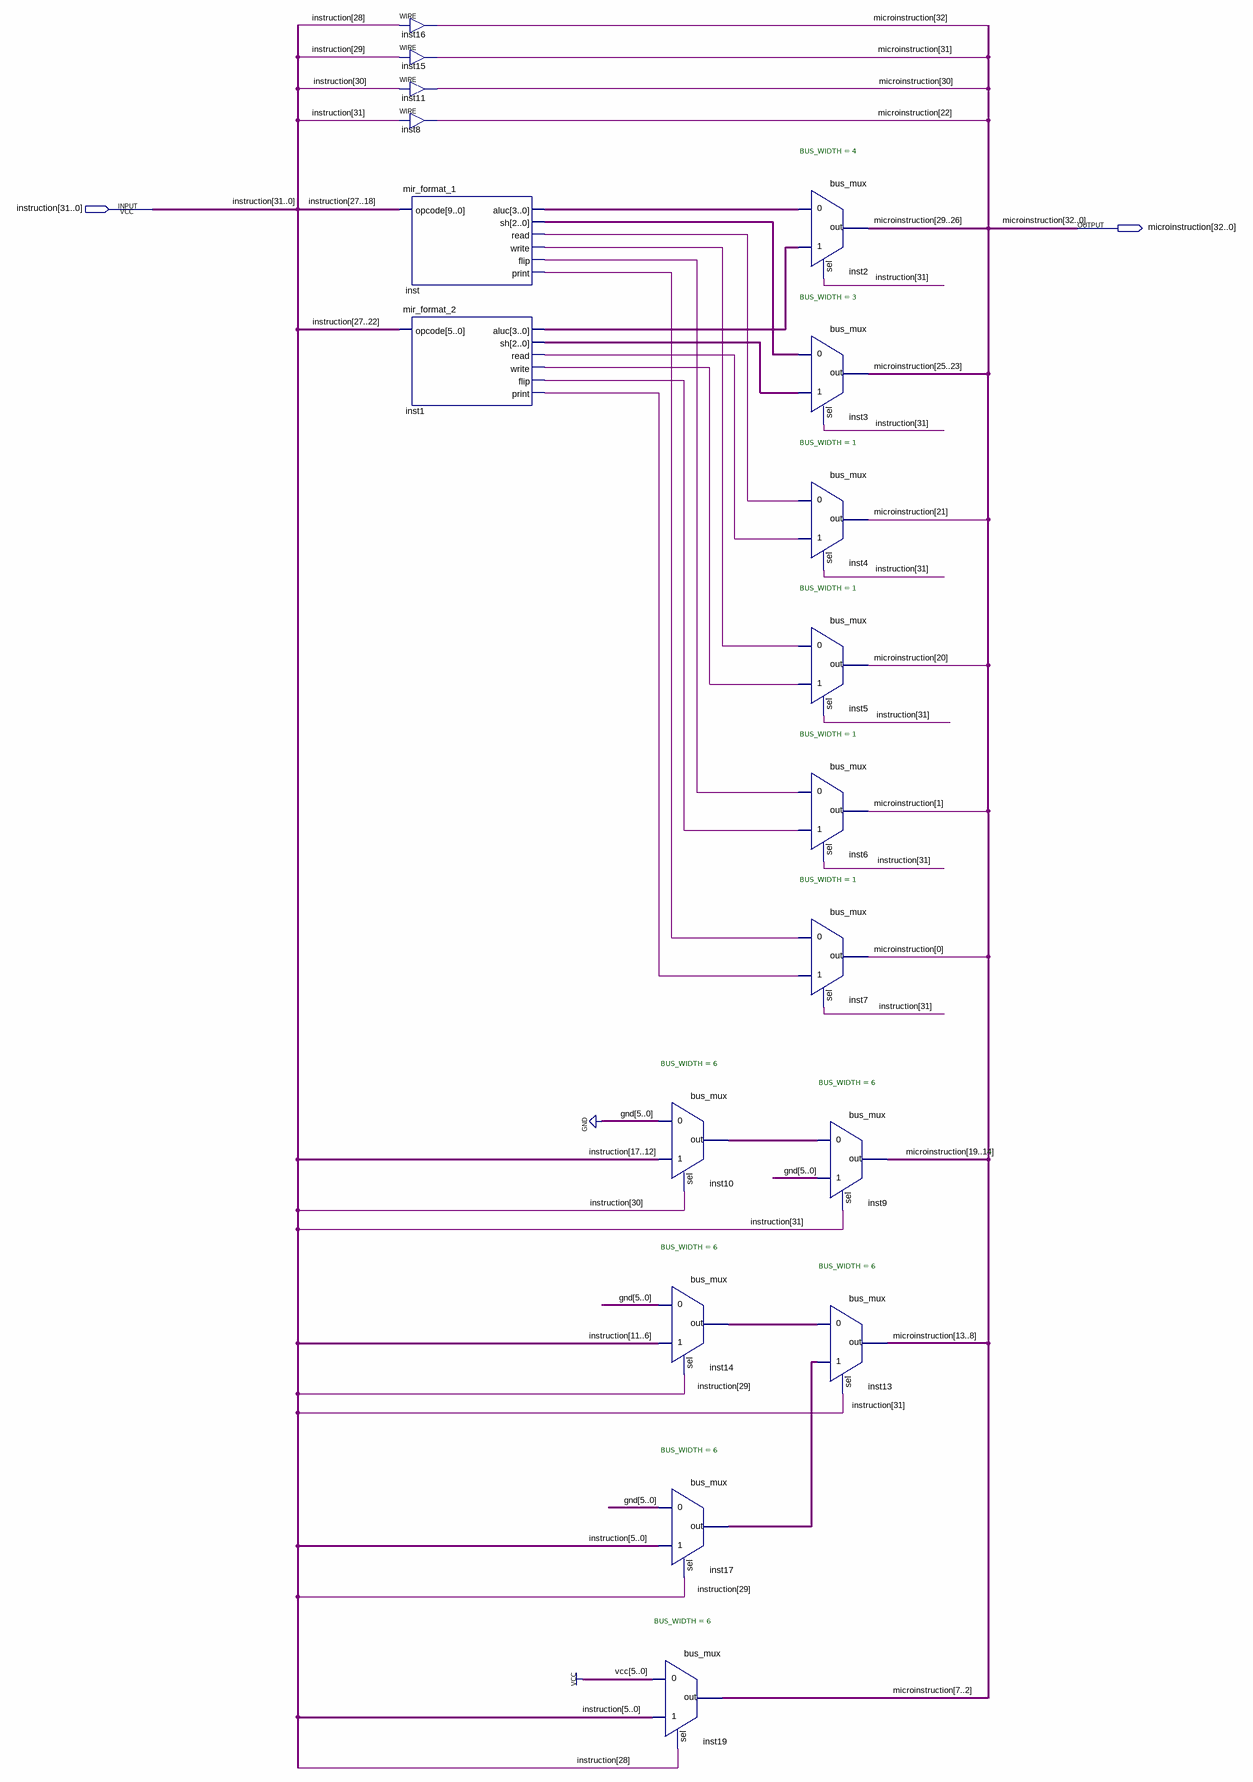
[diagram p0: schematic sheet]
// Quartus schematic instruction_decoder.bdf as structural Verilog: 18 symbols, 2 pins
module instruction_decoder (
  input  [31:0] instruction,
  output [32:0] microinstruction
);

  wire inst1_flip, inst1_print, inst1_read, inst1_write, inst_flip, inst_print, inst_read, inst_write;
  wire [2:0] inst1_sh, inst_sh;
  wire [3:0] inst1_aluc, inst_aluc;
  wire [5:0] inst10_out, inst14_out, inst17_out;

  assign microinstruction[32] = instruction[28];  // WIRE inst16
  assign microinstruction[31] = instruction[29];  // WIRE inst15
  assign microinstruction[30] = instruction[30];  // WIRE inst11
  assign microinstruction[22] = instruction[31];  // WIRE inst8
  mir_format_1 inst (
    .opcode(instruction[27:18]), .aluc(inst_aluc), .sh(inst_sh), .read(inst_read), .write(inst_write),
    .flip(inst_flip), .print(inst_print));
  mir_format_2 inst1 (
    .opcode(instruction[27:22]), .aluc(inst1_aluc), .sh(inst1_sh), .read(inst1_read), .write(inst1_write),
    .flip(inst1_flip), .print(inst1_print));
  bus_mux #(.BUS_WIDTH(6)) inst10 (.in0({6{1'b0}}), .in1(instruction[17:12]), .sel(instruction[30]), .out(inst10_out));
  bus_mux #(.BUS_WIDTH(6)) inst14 (.in0({6{1'b0}}), .in1(instruction[11:6]), .sel(instruction[29]), .out(inst14_out));
  bus_mux #(.BUS_WIDTH(6)) inst17 (.in0({6{1'b0}}), .in1(instruction[5:0]), .sel(instruction[29]), .out(inst17_out));
  bus_mux #(.BUS_WIDTH(6)) inst19 (
    .in0({6{1'b1}}), .in1(instruction[5:0]), .sel(instruction[28]), .out(microinstruction[7:2]));
  bus_mux #(.BUS_WIDTH(4)) inst2 (
    .in0(inst_aluc), .in1(inst1_aluc), .sel(instruction[31]), .out(microinstruction[29:26]));
  bus_mux #(.BUS_WIDTH(3)) inst3 (.in0(inst_sh), .in1(inst1_sh), .sel(instruction[31]), .out(microinstruction[25:23]));
  bus_mux #(.BUS_WIDTH(1)) inst4 (.in0(inst_read), .in1(inst1_read), .sel(instruction[31]), .out(microinstruction[21]));
  bus_mux #(.BUS_WIDTH(1)) inst5 (
    .in0(inst_write), .in1(inst1_write), .sel(instruction[31]), .out(microinstruction[20]));
  bus_mux #(.BUS_WIDTH(1)) inst6 (.in0(inst_flip), .in1(inst1_flip), .sel(instruction[31]), .out(microinstruction[1]));
  bus_mux #(.BUS_WIDTH(1)) inst7 (
    .in0(inst_print), .in1(inst1_print), .sel(instruction[31]), .out(microinstruction[0]));
  bus_mux #(.BUS_WIDTH(6)) inst9 (
    .in0(inst10_out), .in1({6{1'b0}}), .sel(instruction[31]), .out(microinstruction[19:14]));
  bus_mux #(.BUS_WIDTH(6)) inst13 (
    .in0(inst14_out), .in1(inst17_out), .sel(instruction[31]), .out(microinstruction[13:8]));
endmodule
